# Altium schematic sheet BSPDSchematic.SchDoc
size 419 x 284 mm; SheetNumber: 1; SheetTotal: 1
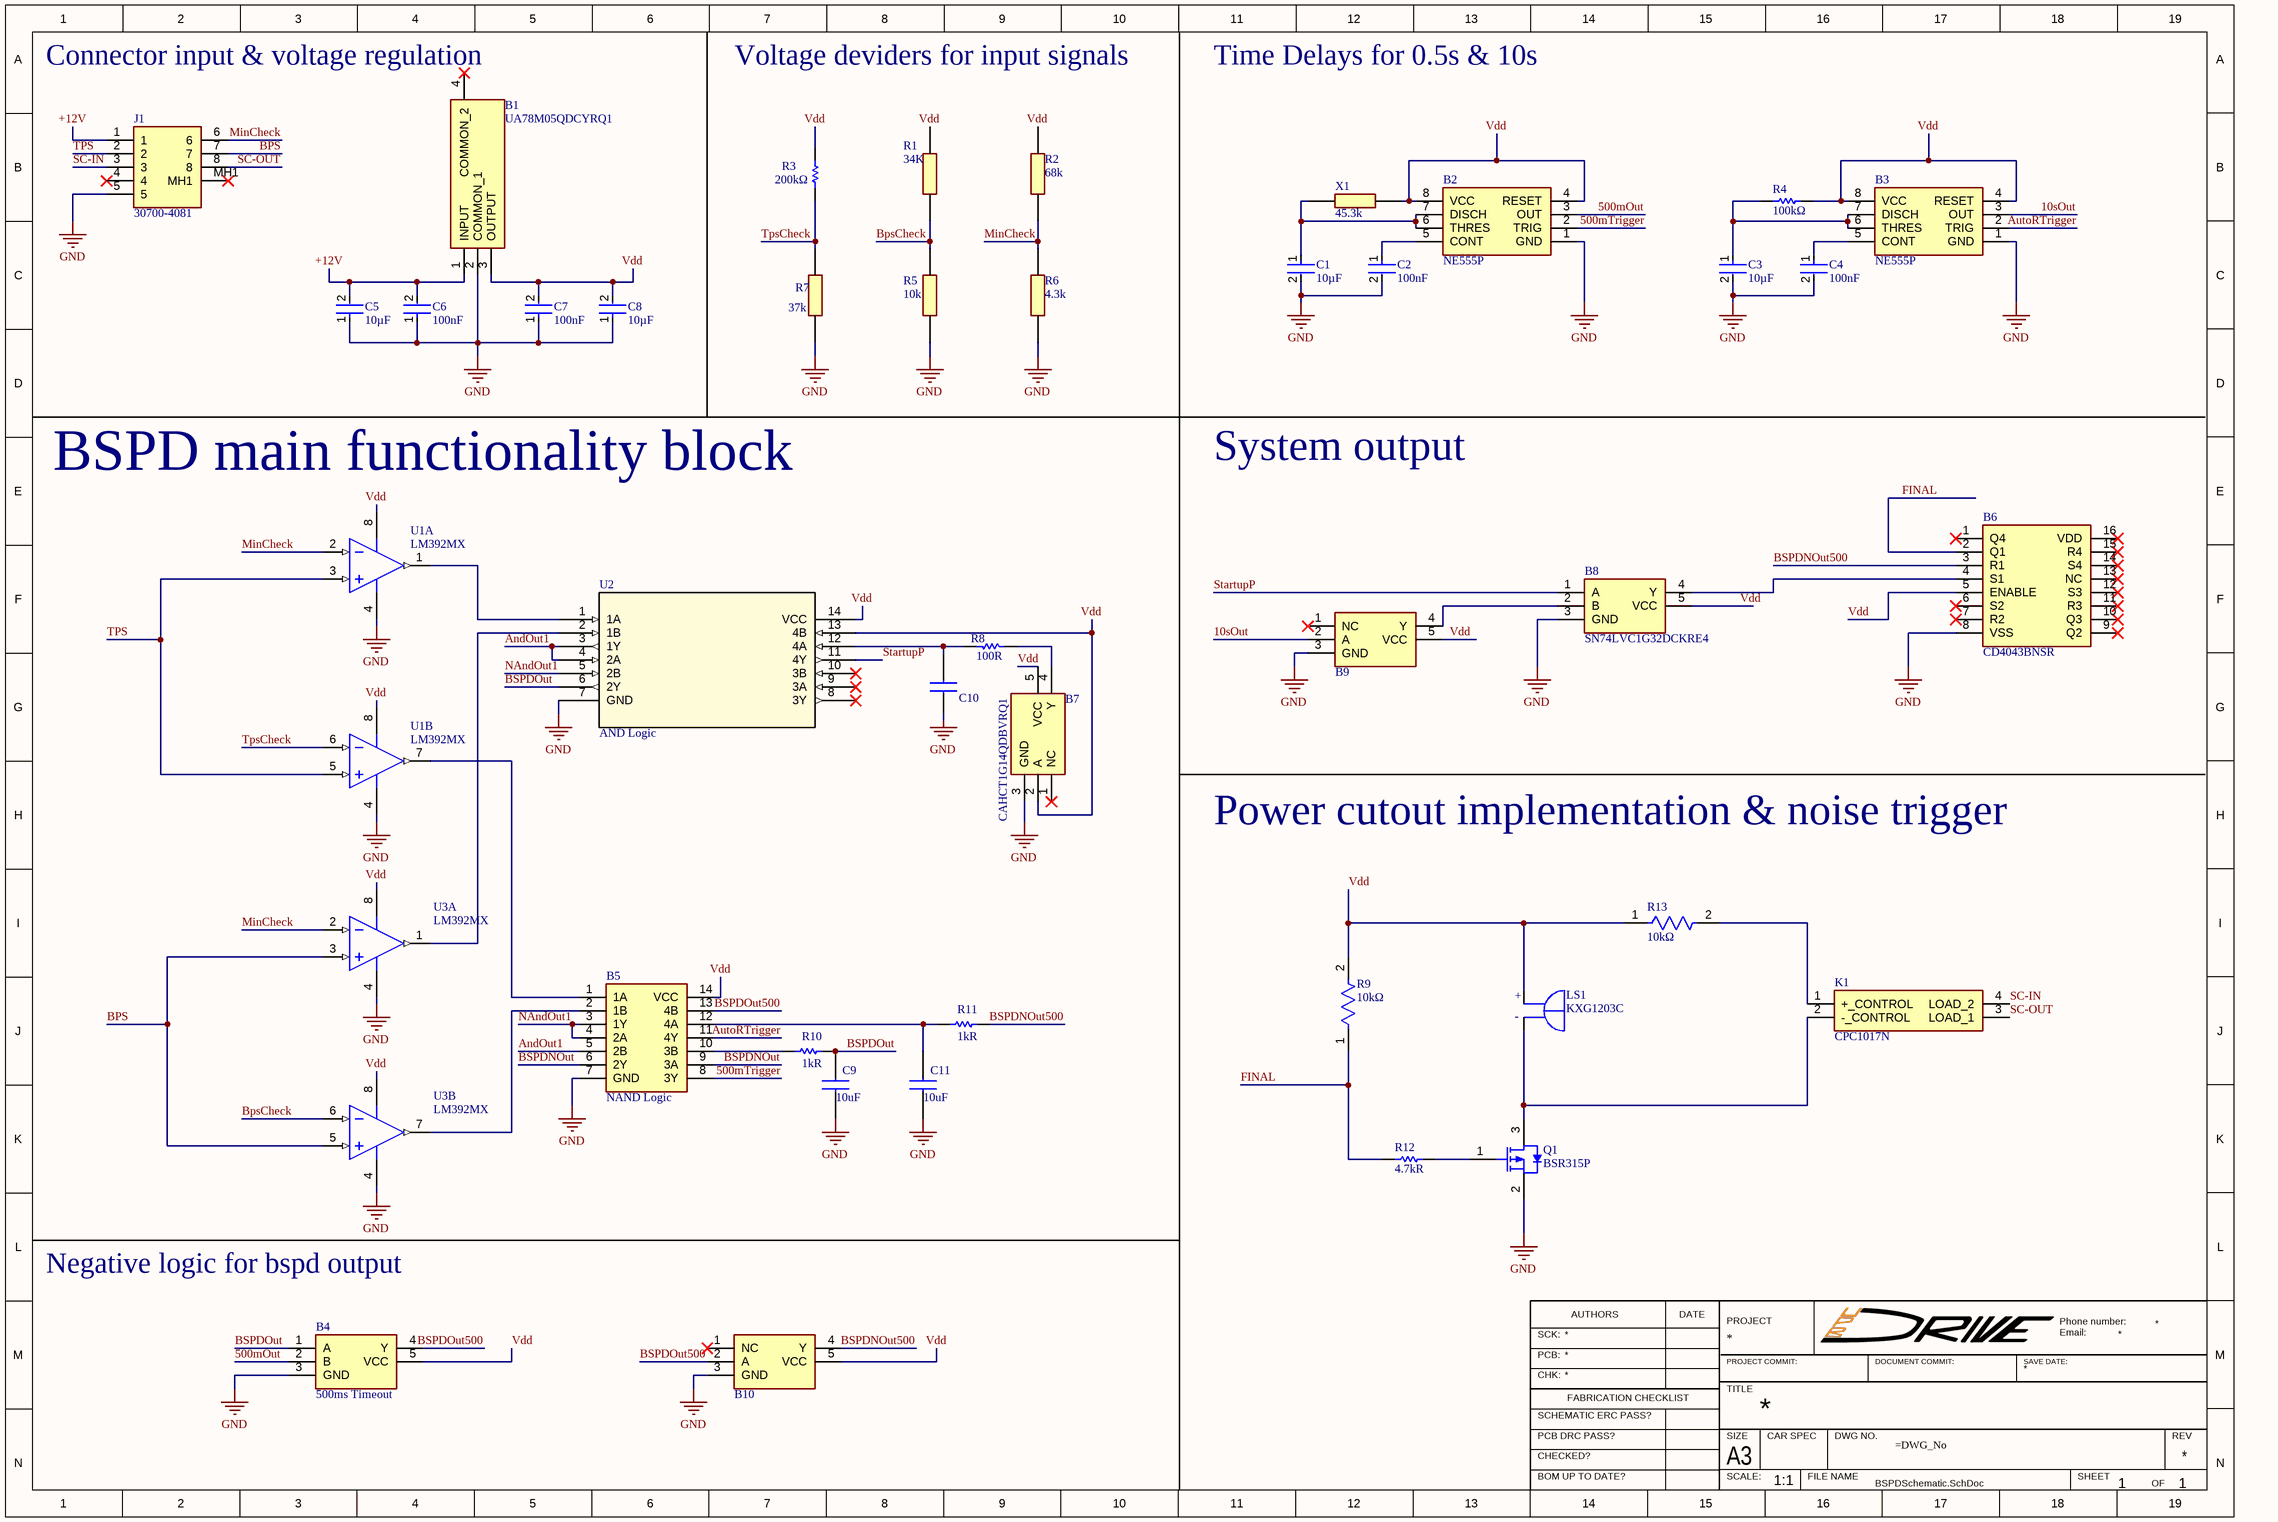
[diagram p0: BSPDSchematic.SchDoc]

## Parts
B1  UA78M05QDCYRQ1  [SOT230P700X180-4N]
B2  NE555P  [DIP794W53P254L959H508Q8N]
B3  NE555P  [DIP794W53P254L959H508Q8N]
B4  500ms Timeout  [SOT65P210X110-5N]
B5  NAND Logic  [SOIC127P780X200-14N]
B6  CD4043BNSR  [SOIC127P780X200-16N]
B7  CAHCT1G14QDBVRQ1  [SOT95P280X145-5N]
B8  SN74LVC1G32DCKRE4  [SOT65P210X110-5N]
B9  CAHCT1G14QDBVRQ1  [SOT95P280X145-5N]  (value not drawn)
B10  CAHCT1G14QDBVRQ1  [SOT95P280X145-5N]  (value not drawn)
C1  value 10µF  [FP-GRM21B-0_2-e0_2_0_7-MFG]  (hidden comment: GRM21BR61H106ME43K)
C2  value 100nF  [FP-CL31-IPC_C]  (hidden comment: CL31B104KBCNNNL)
C3  value 10µF  [FP-GRM21B-0_2-e0_2_0_7-MFG]  (hidden comment: GRM21BR61H106ME43K)
C4  value 100nF  [FP-CL31-IPC_C]  (hidden comment: CL31B104KBCNNNL)
C5  value 10µF  [FP-GRM21B-0_2-e0_2_0_7-MFG]  (hidden comment: GRM21BR61H106ME43K)
C6  value 100nF  [FP-0805-L_2_01_0_2-W_1_25-IPC_B]  (hidden comment: 08051C104K4Z2A)
C7  value 100nF  [FP-0805-L_2_01_0_2-W_1_25-IPC_B]  (hidden comment: 08051C104K4Z2A)
C8  value 10µF  [FP-GRM21B-0_2-e0_2_0_7-MFG]  (hidden comment: GRM21BR61H106ME43K)
C9  value 10uF  [GRM21BR60J226ME39L]  (hidden comment: GRM21BC81D106KE51K)
C10  CL31A107MQHNNWE  [CAPC3216X180N]  (value not drawn)
C11  value 10uF  [GRM21BR60J226ME39L]  (hidden comment: GRM21BC81D106KE51K)
J1  30700-4081  [307004081]
K1  CPC1017N  [SOP254P610X206-4N]
LS1  KXG1203C  [XDCR_KXG1203C]
Q1  BSR315P  [INF-PG-SC59_M]
R1  34K  [MCS04020C1003FE000]
R2  68k  [RESC1608X55N]
R3  value 200kΩ  [RESC2013X60X35ML10T20]  (hidden comment: RC0805FR-13200KL)
R4  value 100kΩ  [RESC2013X60X30ML20T20]  (hidden comment: RK73H2ATTD1003F)
R5  10k  [RESC6332X70N]
R6  4.3k  [RESC1608X50N]
R7  37k  [RESC1608X55N]
R8  value 100R  [RESC3116X65X40ML10T20]  (hidden comment: RC1206FR-07100RL)
R9  value 10kΩ  [FP-RN731J-IPC_B]  (hidden comment: RN73C1J10KB)
R10  value 1kR  [RESC3216X60X45LL15T20]  (hidden comment: CRCW12061K00FKEA)
R11  value 1kR  [RESC3216X60X45LL15T20]  (hidden comment: CRCW12061K00FKEA)
R12  value 4.7kR  [RESC3216X60X45LL15T20]  (hidden comment: CRCW12064K70FKEA)
R13  value 10kΩ  [FP-RN731J-IPC_B]  (hidden comment: RN73C1J10KB)
U1  LM392MX  [D0008A_L]  (parts A,B of 2)
U2  AND Logic  [D14]
U3  LM392MX  [D0008A_L]  (parts A,B of 2)
X1  45.3k  [RESC3216X65N]

## Nets
GND: B1.2(COMMON_1) B2.1(GND) B3.1(GND) B4.3(GND) B5.7(GND) B6.8(VSS) B7.3(GND) B8.3(GND) B9.3(GND) B10.3(GND) C1.2 C2.2 C3.2 C4.2 C5.1 C6.1 C7.1 C8.1 C9.1 C10.1 C11.1 J1.5 Q1.2(SOURCE) R5.1 R6.1 R7.1 U1.4(GND) U2.7(GND) U3.4(GND)
10sOut: B3.3(OUT) B9.2(A)
500mOut: B2.3(OUT) B4.2(B)
500mTrigger: B2.2(TRIG) B5.8(3Y)
+12V: B1.1(INPUT) C5.2 C6.2 J1.1
AndOut1: B5.5(2B) U2.3(1Y) U2.4(2A)
AutoRTrigger: B3.2(TRIG) B5.11(4Y)
BPS: J1.7 U3.3(INA+) U3.5(INB+)
BpsCheck: R1.1 R5.2 U3.6(INB-)
BSPDNOut: B5.6(2Y) B5.9(3A)
BSPDNOut500: B6.3(R1) B10.4(Y) R11.2
BSPDOut: B4.1(A) C9.2 R10.2 U2.6(2Y)
BSPDOut500: B4.4(Y) B5.13(4B) B10.2(A)
FINAL: B6.2(Q1) R9.1 R12.1
MinCheck: J1.6 R2.1 R6.2 U1.2(INA-) U3.2(INA-)
NAndOut1: B5.3(1Y) B5.4(2A) U2.5(2B)
SC-IN: J1.3 K1.4(LOAD_2)
SC-OUT: J1.8 K1.3(LOAD_1)
StartupP: B8.1(A) U2.11(4Y)
TPS: J1.2 U1.3(INA+) U1.5(INB+)
TpsCheck: R3.1 R7.2 U1.6(INB-)
Vdd: B1.3(OUTPUT) B2.4(RESET) B2.8(VCC) B3.4(RESET) B3.8(VCC) B4.5(VCC) B5.14(VCC) B6.5(ENABLE) B7.2(A) B7.5(VCC) B8.5(VCC) B9.5(VCC) B10.5(VCC) C7.2 C8.2 LS1.P(POS) R1.2 R2.2 R3.2 R4.1 R9.2 R13.1 U1.8(V+) U2.13(4B) U2.14(VCC) U3.8(V+) X1.1
NetB2_5: B2.5(CONT) C2.1
NetB2_6: B2.6(THRES) B2.7(DISCH) C1.1 X1.2
NetB3_5: B3.5(CONT) C4.1
NetB3_6: B3.6(THRES) B3.7(DISCH) C3.1 R4.2
NetB5_1: B5.1(1A) U1.7(OUTB)
NetB5_2: B5.2(1B) U3.7(OUTB)
NetB5_10: B5.10(3B) R10.1
NetB5_12: B5.12(4A) C11.2 R11.1
NetB6_4: B6.4(S1) B8.4(Y)
NetB7_4: B7.4(Y) R8.1
NetB8_2: B8.2(B) B9.4(Y)
NetC10_2: C10.2 R8.2 U2.12(4A)
NetK1_1: K1.1(+_CONTROL) R13.2
NetK1_2: K1.2(-_CONTROL) LS1.N(NEG) Q1.3(DRAIN)
NetQ1_1: Q1.1(GATE) R12.2
NetU1_1: U1.1(OUTA) U2.1(1A)
NetU2_2: U2.2(1B) U3.1(OUTA)

Not connected (* = marked no-connect by the designer): B1 4(COMMON_2)*; B6 1(Q4)* 6(S2)* 7(R2)* 9(Q2)* 10(Q3)* 11(R3)* 12(S3)* 13(NC)* 14(S4)* 15(R4)* 16(VDD)*; B7 1(NC)*; B9 1(NC)*; B10 1(NC)*; J1 4* MH1*; U2 8(3Y)* 9(3A)* 10(3B)*

## Notes on the sheet
- (near B1) Connector input & voltage regulation
- Voltage deviders for input signals
- Time Delays for 0.5s & 10s
- System output
- BSPD main functionality block
- Power cutout implementation & noise trigger
- Negative logic for bspd output
- SCK:
- AUTHORS
- DATE
- PROJECT
- Phone number:
- Email:
- PCB:
- CHK:
- FABRICATION CHECKLIST
- TITLE
- PROJECT COMMIT:
- DOCUMENT COMMIT:
- SAVE DATE:
- SCHEMATIC ERC PASS?
- PCB DRC PASS?
- CHECKED?
- A3
- SIZE
- SCALE:
- CAR SPEC
- FILE NAME
- DWG NO.
- SHEET
- REV
- BOM UP TO DATE?
- 1:1
- OF
- (in symbol CMP-279-000000-1) +; -

## Library data of the parts
B1 = CMP-243-000000-1: Standard Regulator Pos 5V 0.5A Automotive 4-Pin(3+Tab) SOT-223 T/R; Manufacturer_Name: Texas Instruments; Geometry.Height: 1.8mm; Datasheet Link: https://www.arrow.com/en/products/ua78m05qdcyrq1/texas-instruments; Mouser Price/Stock: https://www.mouser.co.uk/ProductDetail/Texas-Instruments/UA78M05QDCYRQ1?qs=LVErsypW30y8J3NDf5LIpA%3D%3D; Manufacturer_Part_Number: UA78M05QDCYRQ1; Mouser Part Number: 595-UA78M05QDCYRQ1; Design Item ID: UA78M05QDCYRQ1; Source: UA78M05QDCYRQ1.SchLib
B2 B3 = CMP-167-000004-1: Precision timer,NE555P 0.5MHz DIL8 Texas Instruments NE555P, Precision Timer, 4.5  16 V, 8-Pin PDIP; Geometry.Height: 5.08mm; Mouser Price/Stock: https://www.mouser.co.uk/ProductDetail/Texas-Instruments/NE555P?qs=rkhjVJ6%2F3EIf4CWgjIKuKQ%3D%3D; Source: NE555P.SchLib; Manufacturer_Name: Texas Instruments; Design Item ID: NE555P; Datasheet Link: http://www.ti.com/lit/ds/symlink/ne555.pdf; Mouser Part Number: 595-NE555P; Manufacturer_Part_Number: NE555P
B4 = CMP-176-000003-1: IC GATE XOR 1CH 2-INP SC70-5; Manufacturer_Name: Texas Instruments; Geometry.Height: 1.1mm; Mouser Part Number: 595-SN74AHC1G86DCKE4; Design Item ID: SN74AHC1G86DCKRE4; Source: SN74AHC1G86DCKRE4.SchLib; Manufacturer_Part_Number: SN74AHC1G86DCKRE4; Datasheet Link: http://www.ti.com/general/docs/suppproductinfo.tsp?distId=10&gotoUrl=http%3A%2F%2Fwww.ti.com%2Flit%2Fgpn%2Fsn74ahc1g86; Mouser Price/Stock: https://www.mouser.co.uk/ProductDetail/Texas-Instruments/SN74AHC1G86DCKRE4?qs=fSCvMSq5ISXiVG84KUEwUA%3D%3D
B5 = CMP-216-000000-1: Quadruple 2-Input Positive-NAND Gates; Manufacturer_Name: Texas Instruments; Geometry.Height: 2mm; Manufacturer_Part_Number: SN74ACT00NSR; Source: SN74ACT00NSR.SchLib; Mouser Price/Stock: https://www.mouser.co.uk/ProductDetail/Texas-Instruments/SN74ACT00NSR?qs=pdM4geFiyZQ6dUA3Pnq9Sg%3D%3D; Mouser Part Number: 595-SN74ACT00NSR; Design Item ID: SN74ACT00NSR; Datasheet Link: http://www.ti.com/lit/gpn/sn74act00
B6 = CMP-180-000000-1: CMOS Quad NOR R/S Latch with 3-State Outputs; Manufacturer_Name: Texas Instruments; Geometry.Height: 2mm; Source: CD4043BNSR.SchLib; Design Item ID: CD4043BNSR; Manufacturer_Part_Number: CD4043BNSR; Datasheet Link: http://www.ti.com/lit/gpn/cd4043b; Mouser Price/Stock: https://www.mouser.co.uk/ProductDetail/Texas-Instruments/CD4043BNSR?qs=dQbkqP7qjaak3gfhrS2sTg%3D%3D; Mouser Part Number: 595-CD4043BNSR
B7 B9 B10 = CMP-183-000003-1: Automotive single 4.5V-to-5.5V inverter with Schmitt-trigger inputs; Manufacturer_Name: Texas Instruments; Geometry.Height: 1.45mm; Design Item ID: CAHCT1G14QDBVRQ1; Mouser Price/Stock: https://www.mouser.co.uk/ProductDetail/Texas-Instruments/CAHCT1G14QDBVRQ1?qs=dbcCsuKDzFVQWtcvbPNdyw%3D%3D; Datasheet Link: https://www.ti.com/lit/ds/symlink/sn74ahct1g14-q1.pdf?ts=1750857968201&ref_url=https%253A%252F%252Fwww.mouser.it%252F; Mouser Part Number: 595-CAHCT1G14QDBVRQ1; Manufacturer_Part_Number: CAHCT1G14QDBVRQ1; Source: CAHCT1G14QDBVRQ1.SchLib
B8 = CMP-180-000009-1: OR Gate 1-Element 2-IN CMOS 5-Pin SC-70 T/R; Manufacturer_Name: Texas Instruments; Geometry.Height: 1.1mm; Manufacturer_Part_Number: SN74LVC1G32DCKRE4; Datasheet Link: http://www.ti.com/general/docs/suppproductinfo.tsp?distId=10&gotoUrl=http%3A%2F%2Fwww.ti.com%2Flit%2Fgpn%2Fsn74lvc1g32; Design Item ID: SN74LVC1G32DCKRE4; Mouser Price/Stock: https://www.mouser.co.uk/ProductDetail/Texas-Instruments/SN74LVC1G32DCKRE4?qs=nqigI8dpoHId5Bn%2Fo4o8zg%3D%3D; Source: SN74LVC1G32DCKRE4.SchLib; Mouser Part Number: 595-74LVC1G32DCKRE4
C1 C3 C5 C8 = CMP-041-000022-1: Multilayer Ceramic Capacitors MLCC - SMD/SMTSimulate & compare characteristics in SimSurfing; Manufacturer Lifecycle Status: IN PRODUCTION; Voltage Rating: 50V; Tolerance: 20%; Dielectric: X5R; Height: 1.25mm; Voltage Rating (DC): 50V; Lifecycle Status: Production; Case/Package: 0805; Mounting Technology: Surface Mount; Min Operating Temperature: -55°C; Width: 1.25mm; Dielectric Material: Ceramic; REACH SVHC: Yes; Material: Ceramic; RoHS: Compliant; Max Operating Temperature: 85°C; Length: 2mm; Thickness: 1.25mm; Number of Terminals: 2
C2 C4 = CMP-041-000000-1: Ceramic Capacitor, Multilayer, Ceramic, 50V, 10% +Tol, 10% -Tol, X7R, 15% TC, 0.1uF, Surface Mount, 1206
C6 C7 = CMP-041-000019-1: Ceramic Capacitor, Multilayer, Ceramic, 100V, 10% +Tol, 10% -Tol, X7R, 15% TC, 0.1uF, Surface Mount, 0805; Reference Standard: AEC-Q200; Multilayer: Yes; Height: 1.27mm; Tolerance  (fill in as +-): 10%; Temperature Characteristics Code: X7R; Terminal Finish: Nickel; Package Shape: Rectangular; Reach SVHC Compliant: Yes; RoHS Compliant: Yes; Dielectric Material: Ceramic; Length: 2.01mm; Termination: Wraparound; Case/Package: 0805; JESD-609 Code: e3; Capacitor Type: Ceramic; Mounting Technology: Surface Mount; Packaging: Tape and Reel; Tolerance (fill in as +-): 10%; Rated DC Voltage (URdc): 100V; Pins: 2; Width: 1.25mm; Package Style: SMTMeter; Min Operating Temperature: -55°C; Max Operating Temperature: 125°C
C9 C11 = CMP-041-000023-1: Multilayer Ceramic Capacitors MLCC - SMD/SMT 0805 10uF 20volts *Derate Voltage/Temp; Manufacturer_Name: Murata Electronics; Geometry.Height: 1.45mm; Manufacturer_Part_Number: GRM21BC81D106KE51K; Mouser Price/Stock: https://www.mouser.co.uk/ProductDetail/Murata-Electronics/GRM21BC81D106KE51K?qs=QzBtWTOodeX3BXZzorRwZw%3D%3D; Source: GRM21BC81D106KE51K.SchLib; Design Item ID: GRM21BC81D106KE51K; Arrow Part Number: *; Arrow Price/Stock: *; Mouser Part Number: 81-GRM21BC81D106KE1K; Datasheet Link: https://search.murata.co.jp/Ceramy/image/img/A01X/G101/ENG/GRM21BC81D106KE51-01A.pdf
C10 = CMP-041-000025-1: Manufacturer_Name: SAMSUNG; Geometry.Height: 1.8mm; Source: CL31A107MQHNNWE.SchLib; Datasheet Link: https://www.arrow.com/en/products/cl31a107mqhnnwe/samsung-electro-mechanics; Mouser Price/Stock: https://www.mouser.co.uk/ProductDetail/Samsung-Electro-Mechanics/CL31A107MQHNNWE?qs=xZ%2FP%252Ba9zWqZ1plV7MDkjgw%3D%3D; Manufacturer_Part_Number: CL31A107MQHNNWE; Design Item ID: CL31A107MQHNNWE; Mouser Part Number: 187-CL31A107MQHNNWE
J1 = CMP-281-000000-1: Automotive Connectors HDAC64 DR VERT HDR 8 DR 8 CKT BLACK POL 2; Manufacturer_Name: Molex; Geometry.Height: 21.83mm; Mouser Price/Stock: https://www.mouser.co.uk/ProductDetail/Molex/30700-4081?qs=ZlMU7IUseCstceQEx6TmTA%3D%3D; Mouser Part Number: 538-30700-4081; Source: 30700-4081.SchLib; Design Item ID: 30700-4081; Datasheet Link: https://componentsearchengine.com/Datasheets/1/30700-4081.pdf; Manufacturer_Part_Number: 30700-4081
K1 = CMP-126-000001-1: Relay SSR 50mA 1.4V DC-IN 0.1A 60V 4-Pin SOP Tube; Manufacturer_Name: LITTELFUSE; Geometry.Height: 2.055mm; Datasheet Link: https://www.ixysic.com/home/pdfs.nsf/www/CPC1017N.pdf/$file/CPC1017N.pdf; Mouser Part Number: 849-CPC1017N; Design Item ID: CPC1017N; Mouser Price/Stock: https://www.mouser.co.uk/ProductDetail/IXYS-Integrated-Circuits/CPC1017N?qs=h2iAtNzNjMSJoWxc%2FDvCWA%3D%3D; Source: CPC1017N.SchLib; Manufacturer_Part_Number: CPC1017N
LS1 = CMP-279-000000-1: Value: *; Component Type: Standard; MP: KXG1203C; Pin Count: 2; Package: None; Design Item ID: KXG1203C; Price: None; Source: KXG1203C.SchLib; Availability: Unavailable
Q1 = CMP-00007-1: Small Signal Field-Effect Transistor, 0.62A I(D), 60V, 1-Element, P-Channel, Silicon, Metal-oxide Semiconductor FET; Number of Elements: 1; Package Body Material: Plastic; Drain Current-Max (ID): 620mA; Feedback Cap-Max (Crss): 30pF; Reference Standard: AEC-Q101; Drain-source On Resistance-Max: 800mR; Operating Mode: ENHANCEMENT MODE; Package Shape: Rectangular; RoHS Compliant: Yes; DS Breakdown Voltage-Min: 60V; Transistor Element Material: SILICON; Package Style: SMALL OUTLINEMeter; Surface Mount: Yes; Reach SVHC Compliant: Yes; Pins: 3; Moisture Sensitivity Level: 1; Terminal Position: DUAL; Polarity/Channel Type: P-CHANNEL; JESD-30 Code: R-PDSO-G3; Terminal Form: Gull Wing; FET Technology: METAL-OXIDE SEMICONDUCTOR
R1 = CMP-150-000008-1: Vishay Resistor Chip 0402; Geometry.Height: 0.37mm; Source: MCS04020D3402BE000.SchLib; Design Item ID: MCS04020D3402BE000; Manufacturer_Name: Vishay; Manufacturer_Part_Number: MCS04020D3402BE000; Mouser Price/Stock: *; Mouser Part Number: *; Datasheet Link: http://www.vishay.com/docs/28705/mcx0x0xpro.pdf
R2 = CMP-191-000001-1: Thin Film Resistors - SMD MCT 0603-15 0.1% AT P5 68K; Manufacturer_Name: Vishay; Geometry.Height: 0.55mm; Manufacturer_Part_Number: MCT0603ME6802BP500; Design Item ID: MCT0603ME6802BP500; Mouser Price/Stock: https://www.mouser.co.uk/ProductDetail/Vishay/MCT0603ME6802BP500?qs=Wj%2FVkw3K%252BMDGy1OX8yGPTg%3D%3D; Source: MCT0603ME6802BP500.SchLib; Mouser Part Number: 594-MCT0603ME6802BP5; Datasheet Link: http://www.vishay.com/docs/28705/mcx0x0xpro.pdf
R3 = CMP-00087-1: Res Thick Film 0805 200K Ohm 1% 0.125W(1/8W) ±100ppm/C Molded SMD T/R; Working Voltage: 150V; Power Rating: 125mW; Temperature Coefficient: 100ppm/°C; Lead Free: Lead Free; Case/Package: 0805; REACH SVHC: Yes; Mounting Technology: Surface Mount; China RoHS: Non-Compliant; RoHS: Compliant; Min Operating Temperature: -55°C; Width: 1.25mm; Packaging: Tape & Reel; Voltage Rating: 150V; Composition: Thick Film; Tolerance: 1%; Termination: SMD/SMT; Length: 2mm; Height: 500µm; Schedule B: 8533210045, 8533210045; Power Dissipation: 125mW; Contact Plating: Tin; Number of Terminals: 2; Lifecycle Status: Production; Case Code (Metric): 2012; Case Code (Imperial): 0805; Max Operating Temperature: 155°C; Radiation Hardening: No
R4 = CMP-00089-1: Resistor Thick Film 0805 100K Ohm 1% 1/8W ±100ppm/°C SMD Punched Paper Tape and Reel; Power Dissipation: 250mW; Working Voltage: 150V; Power Rating: 125mW; Lead Free: Lead Free; Case/Package: 0805; Military Standard: Not; Lifecycle Status: Production; Max Operating Temperature: 155°C; Temperature Coefficient: 100ppm/°C; Schedule B: 8533210045, 8533210045; Voltage Rating (DC): 150V; Pins: 2; REACH SVHC: Yes; Tolerance: 1%; Number of Terminals: 2; Termination: SMD/SMT; Voltage Rating: 150V; Height: 500µm; Case Code (Imperial): 0805; Width: 1.25mm; Mounting Technology: Surface Mount; Depth: 1.25mm; Length: 2mm; China RoHS: Non-Compliant; Composition: Thick Film; Case Code (Metric): 2012; Min Operating Temperature: -55°C; RoHS: Compliant
R5 = CMP-150-000009-1: 10 +/-5% 1W Chip Resistor 2512 (6432 Metric) Automotive AEC-Q200 Thick Film; Manufacturer_Name: Bourns; Geometry.Height: 0.7mm; Mouser Part Number: 652-CR2512AJW-103ELF; Design Item ID: CR2512AJW-103ELF; Manufacturer_Part_Number: CR2512AJW-103ELF; Mouser Price/Stock: https://www.mouser.co.uk/ProductDetail/Bourns/CR2512AJW-103ELF?qs=GedFDFLaBXEqggePGBQmuQ%3D%3D; Source: CR2512AJW-103ELF.SchLib; Datasheet Link: https://www.bourns.com/docs/product-datasheets/crxxxxa.pdf
R6 = CMP-194-000000-1: Thick Film Resistors - SMD 1/10watt 4.3Kohms 1%; Manufacturer_Name: Vishay; Geometry.Height: 0.5mm; Datasheet Link: http://www.vishay.com/docs/20035/dcrcwe3.pdf; Manufacturer_Part_Number: CRCW06034K30FKTA; Design Item ID: CRCW06034K30FKTA; Source: CRCW06034K30FKTA.SchLib; Mouser Price/Stock: https://www.mouser.co.uk/ProductDetail/Vishay-Dale/CRCW06034K30FKTA?qs=QIF1izkZhqViEzAn5govYA%3D%3D; Mouser Part Number: 71-CRCW0603-4.3K
R7 = CMP-222-000000-1: Lead (Pb)-Bearing High Stability Thin Film Chip Resistors; Manufacturer_Name: Vishay; Geometry.Height: 0.55mm; Design Item ID: TNPW060337K0BEEA; Source: TNPW060337K0BEEA.SchLib; Mouser Price/Stock: https://www.mouser.co.uk/ProductDetail/Vishay-Dale/TNPW060337K0BEEA?qs=ys0FHdAnsy4FXZekmjUp%2FA%3D%3D; Datasheet Link: https://www.vishay.com/docs/28758/tnpw_e3.pdf; Mouser Part Number: 71-TNPW060337K0BEEA; Manufacturer_Part_Number: TNPW060337K0BEEA
R8 = CMP-00048-1: Fixed Resistor, Metal Glaze/thick Film, 0.25W, 100ohm, 200V, 1% +/-Tol, 100ppm/Cel, Surface Mount, 1206; Additional Feature: LASER TRIMMABLE; Rated Temperature: 70°C; Package Length: 3.1mm; Temperature Coefficient (ppm/Cel): 100; Package Height: 0.55mm; Package Width: 1.6mm; Power: 250mW; Termination: Wraparound; Technology: METAL GLAZE/THICK FILM; Reach SVHC Compliant: Yes; Terminal Finish: Nickel; Construction: Chip; Working Voltage: 200V; Packaging: Tape and Reel; JESD-609 Code: e3; Case/Package: 1206; Min Operating Temperature: -55°C; RoHS Compliant: Yes; Max Operating Temperature: 155°C; Mounting Technology: Surface Mount; Tolerance: 1%; Resistor Type: FIXED RESISTOR; Pins: 2; Package Shape: Rectangular
R9 R13 = CMP-00083-1: RN 0603 SMD precision chip resistor 10K; Voltage Rating: 50V; Temperature Coefficient: 10ppm/°C; Tolerance: 0.1%; Power Rating: 63mW; RoHS: Compliant; Case/Package: 0603; Max Operating Temperature: 155°C; Height: 550µm; Depth: 800µm; Length: 1.6mm; Min Operating Temperature: -55°C; Composition: Thin Film
R10 R11 = CRCW12061K00FKEA-1: Fixed Resistor, Metal Glaze/thick Film, 0.25W, 1000ohm, 200V, 1% +/-Tol, 100ppm/Cel, Surface Mount, 1206; Temperature Coefficient: 100ppm/°C; Package Height: 0.55mm; Rated Temperature: 70°C; Reference Standard: AEC-Q200; Package Width: 1.6mm; Power: 250mW; Package Length: 3.2mm; Additional Feature: RATED AC VOLTAGE (V): 200; Package Style: SMTMeter; Resistor Type: FIXED RESISTOR; RoHS Compliant: Yes; Technology: METAL GLAZE/THICK FILM; Packaging: Tape and Reel; Pins: 2; Working Voltage: 200V; Reach SVHC Compliant: Yes; Termination: Wraparound; JESD-609 Code: e3; Tolerance: 1%; Min Operating Temperature: -55°C; Package Shape: Rectangular; Construction: Chip; Case/Package: 1206; Terminal Finish: Nickel; Max Operating Temperature: 155°C; Mounting Technology: Surface Mount
R12 = CRCW12064K70FKEA-1: Fixed Resistor, Metal Glaze/thick Film, 0.25W, 4700ohm, 200V, 1% +/-Tol, 100ppm/Cel, Surface Mount, 1206; Rated Temperature: 70°C; Package Width: 1.6mm; Package Length: 3.2mm; Power: 250mW; Additional Feature: RATED AC VOLTAGE (V): 200; Package Height: 0.55mm; Reference Standard: AEC-Q200; Temperature Coefficient: 100ppm/°C; Max Operating Temperature: 155°C; Tolerance: 1%; Resistor Type: FIXED RESISTOR; Package Shape: Rectangular; Technology: METAL GLAZE/THICK FILM; Mounting Technology: Surface Mount; Min Operating Temperature: -55°C; RoHS Compliant: Yes; Packaging: Tape and Reel; Case/Package: 1206; Construction: Chip; Termination: Wraparound; Reach SVHC Compliant: Yes; Working Voltage: 200V; Package Style: SMTMeter; JESD-609 Code: e3; Terminal Finish: Nickel; Pins: 2
U1 U3 = CMP-00081-1: lm392-N Low Power Operational Amplifier/Voltage Comparator; Input Bias Current: 250nA; Output Current: 16mA; Nominal Supply Current: 600µA; Operating Supply Voltage: 16V; Input Offset Voltage (Vos): 5mV; Number of Channels: 2; Min Dual Supply Voltage: 1.5V; Common Mode Rejection Ratio: 65dB; Gain Bandwidth Product: 1MHz; Min Operating Temperature: 0°C; Case/Package: SOIC; RoHS: Non-Compliant; Pins: 8; Lead Free: Contains Lead; Max Operating Temperature: 70°C; Mounting Technology: Surface Mount; Radiation Hardening: No
U2 = CMP-213-000000-1: 4-ch, 2-input, 2-V to 6-V 5.2 mA drive strength AND gate 14-SOIC -55 to 125; Manufacturer_Name: Texas Instruments; Datasheet: https://www.ti.com/lit/gpn/cd74hc08; Copyright: Copyright (C) 2025 Ultra Librarian. All rights reserved.; Manufacturer_Part_Number: CD74HC08M; RefDes: RefDes; Source: CD74HC08M.SchLib; Type: Type; Design Item ID: CD74HC08M
X1 = CMP-207-000000-1: Thick Film Resistors - SMD 1206 45.3Kohm 1% High VoltageAEC-Q200; Manufacturer_Name: ROHM Semiconductor; Geometry.Height: 0.65mm; Manufacturer_Part_Number: KTR18EZPF4532; Datasheet Link: http://rohmfs.rohm.com/en/products/databook/datasheet/passive/resistor/chip_resistor/ktr.pdf; Mouser Price/Stock: https://www.mouser.co.uk/ProductDetail/ROHM-Semiconductor/KTR18EZPF4532?qs=493kPxzlxfIcD4BSA1SqXw%3D%3D; Source: KTR18EZPF4532.SchLib; Mouser Part Number: 755-KTR18EZPF4532; Design Item ID: KTR18EZPF4532